# EAGLE design frankShield (EAGLE 7.5.0)
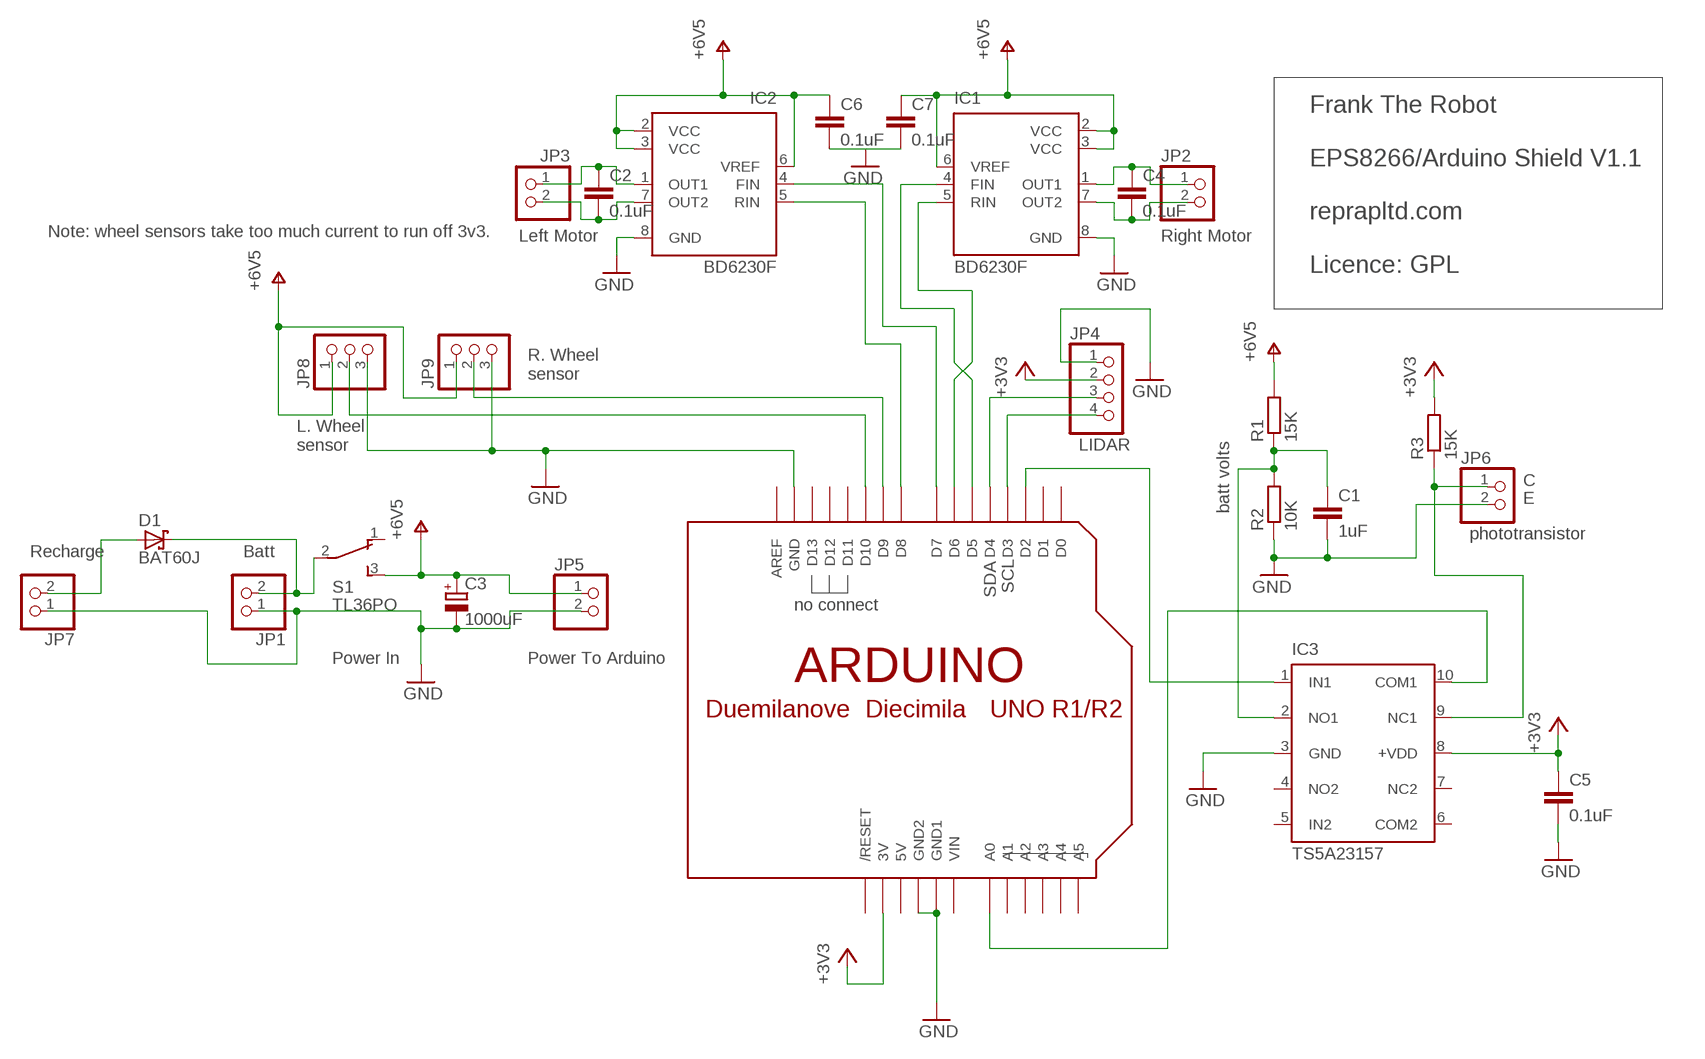
[diagram p0: schematic, sheet 1]

## Parts
C1  1uF  C-EUC0805  [C0805]
C2  0.1uF  C-EUC0805  [C0805]
C3  1000uF  CPOL-EUB45181B  [B45181B]
C4  0.1uF  C-EUC0805  [C0805]
C5  0.1uF  C-EUC0805  [C0805]
C6  0.1uF  C-EUC0805  [C0805]
C7  0.1uF  C-EUC0805  [C0805]
D1  BAT60J  [SOD323_ST]
IC1  BD6230F  [SOP8]
IC2  BD6230F  [SOP8]
IC3  TS5A23157  [MSOP10]
JP1  PINHD-1X2  [1X02]
JP2  PINHD-1X2  [1X02]
JP3  PINHD-1X2  [1X02]
JP4  PINHD-1X4  [1X04]
JP5  PINHD-1X2  [1X02]
JP6  PINHD-1X2  [1X02]
JP7  PINHD-1X2  [1X02]
JP8  PINHD-1X3  [1X03]
JP9  PINHD-1X3  [1X03]
R1  15K  R-EU_M0805  [M0805]
R2  10K  R-EU_M0805  [M0805]
R3  15K  R-EU_M0805  [M0805]
S1  TL36PO  [TL3XPO]
U$1  ARDUINO-BPLACE  [ARDUINO-BPLACE]

## Nets
+3V3: C5.1 IC3.8(+VDD) JP4.2 R3.2 U$1.3V
GND: C1.2 C3.- C5.2 C6.2 C7.2 IC1.8(GND) IC2.8(GND) IC3.3(GND) JP1.1 JP4.1 JP5.2 JP6.2 JP7.1 JP8.3 JP9.3 R2.1 U$1.GND U$1.GND1 U$1.GND2
N$1: JP4.4 U$1.D3
N$2: JP4.3 U$1.D4
N$3: C2.1 IC2.1(OUT1) JP3.1
N$4: C2.2 IC2.7(OUT2) JP3.2
N$5: C4.1 IC1.1(OUT1) JP2.1
N$6: C4.2 IC1.7(OUT2) JP2.2
N$7: IC1.5(RIN) U$1.D6
N$8: IC1.4(FIN) U$1.D5
N$9: IC2.4(FIN) U$1.D7
N$10: IC2.5(RIN) U$1.D8
N$11: IC3.10(COM1) U$1.A0
N$12: C1.1 IC3.2(NO1) R1.1 R2.2
N$13: D1.C JP1.2 S1.2(P)
N$14: IC3.9(NC1) JP6.1 R3.1
N$15: IC3.1(IN1) U$1.D2
N$16: D1.A JP7.2
N$17: JP9.2 U$1.D9
N$18: JP8.2 U$1.D10
V+: C3.+ C6.1 C7.1 IC1.2(VCC) IC1.3(VCC) IC1.6(VREF) IC2.2(VCC) IC2.3(VCC) IC2.6(VREF) JP5.1 JP8.1 JP9.1 R1.2 S1.3(S) ; supply symbol labelled +6V5
Unconnected: IC3.4(NO2) IC3.5(IN2) IC3.6(COM2) S1.1(O) U$1.A1 U$1.A2 U$1.A3 U$1.A4 U$1.A5 U$1.AREF U$1.D0 U$1.D1 U$1.D11 U$1.D12 U$1.D13 U$1.RESET(/RESET)

## Notes on the sheet
- Note: wheel sensors take too much current to run off 3v3. | Left Motor | Right Motor
- Frank The Robot
  
  EPS8266/Arduino Shield V1.1
  
  reprapltd.com
  
  Licence: GPL
- R. Wheel
  sensor
- L. Wheel
  sensor
- LIDAR
- C
- E
- batt volts
- phototransistor
- Recharge | Batt
- SDA | SCL
- no connect
- Power In | Power To Arduino

## Power pins joined to a net without a drawn wire
5V: U$1.5V
NC2: IC3.7(NC2)
VIN: U$1.VIN

## Library data of the parts
C1 C2 C4-C7 = rcl:C-EU: CAPACITOR, European symbol
C3 = rcl:CPOL-EU: POLARIZED CAPACITOR, European symbol
D1 = diode:BAT60J: Schottky barrier diode Source: www.st.com, BAT60J.pdf
IC1 IC2 = rohm:BD623*F: H-bridge driver for brush motors Source: http://www.rohm.com/products/databook/motor/pdf/bd623x_series-e.pdf; MPN: BD6230F-E2; OC_FARNELL: 1716264; OC_NEWARK: 15R0529
IC3 = reprapltd:TS5A23157: 2-Channel, 12-Bit ADC with I2C-Compatible Interface 10-Lead MSOP Source: http://www.analog.com/UploadedFiles/Data_Sheets/224965274AD7992_0.pdf; MPN: AD7992BRMZ-0; OC_FARNELL: 1078311; OC_NEWARK: 31M4422
JP1-JP3 JP5-JP7 = pinhead:PINHD-1X2: PIN HEADER
JP4 = pinhead:PINHD-1X4: PIN HEADER
JP8 JP9 = pinhead:PINHD-1X3: PIN HEADER
R1-R3 = rcl:R-EU_: RESISTOR, European symbol
S1 = switch:TL36PO: TINY SWITCH ON - ON Source: http://www2.produktinfo.conrad.com/datenblaetter/700000-724999/705152-da-01-de-Subminiaturschalter_TL_36YO.pdf
U$1 = adafruit:ARDUINO: Arduino Diecimila/Duemilanove Make a shield with ease, this package has all the named pins as well as the two mounting drill holes and an outline of the USB and DC power connector. The outline is on the DIMENSION layer, so if your board house uses it they will cut the outline to match. http://www.ladyada.net/library/pcb/eaglelibrary.html

## Board
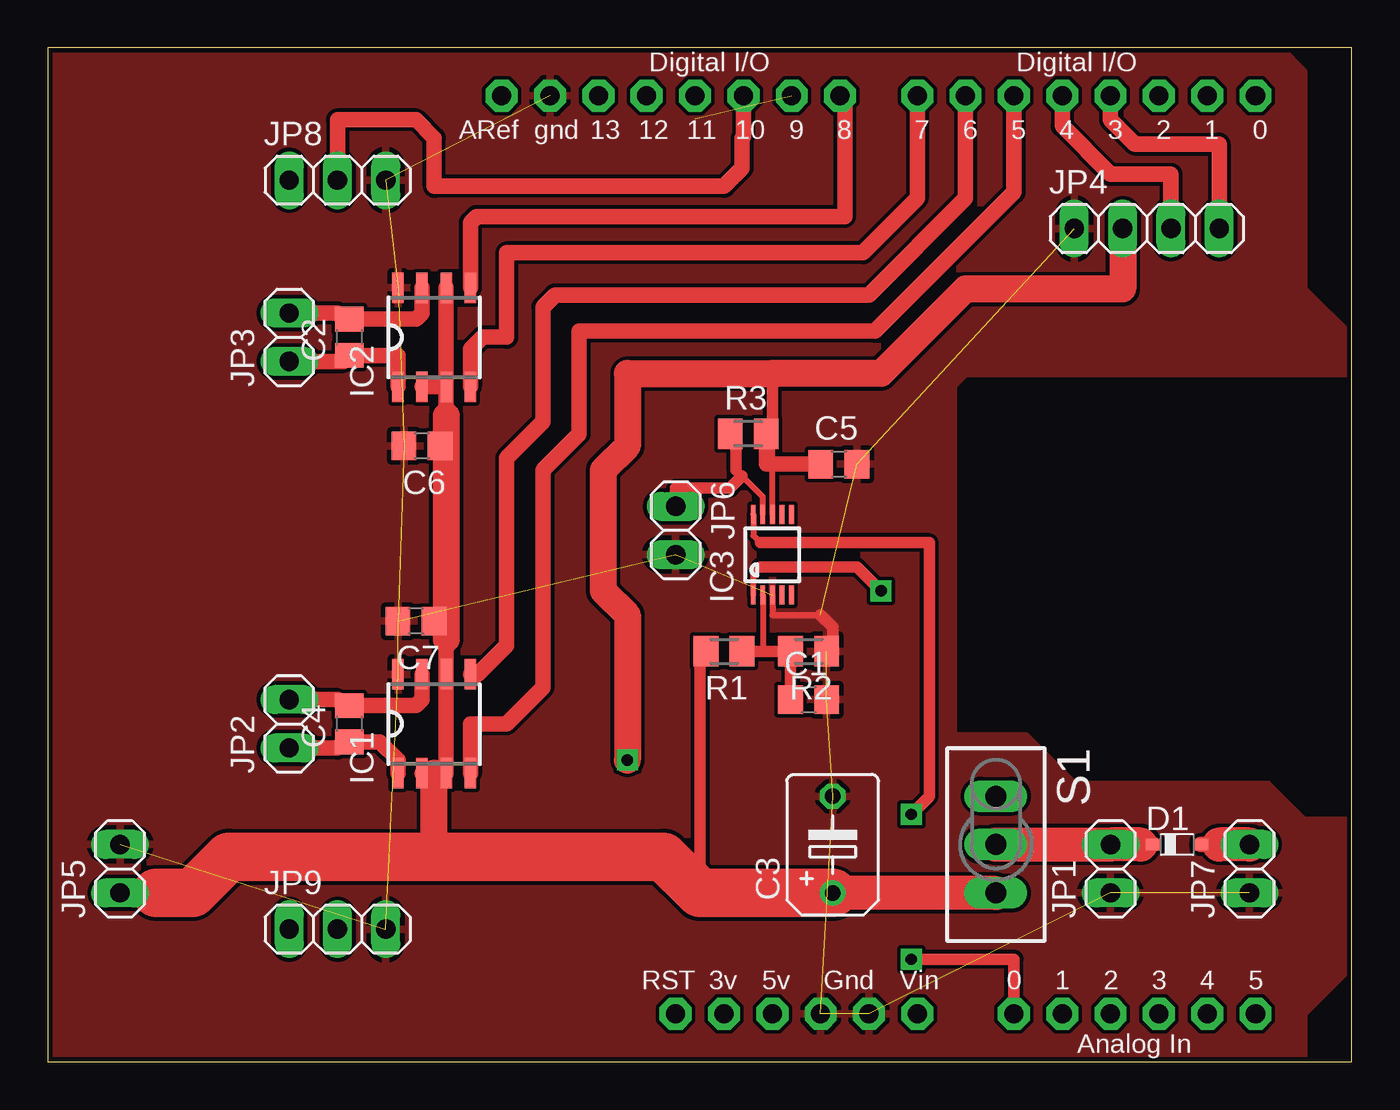
[diagram p1: board, top side]
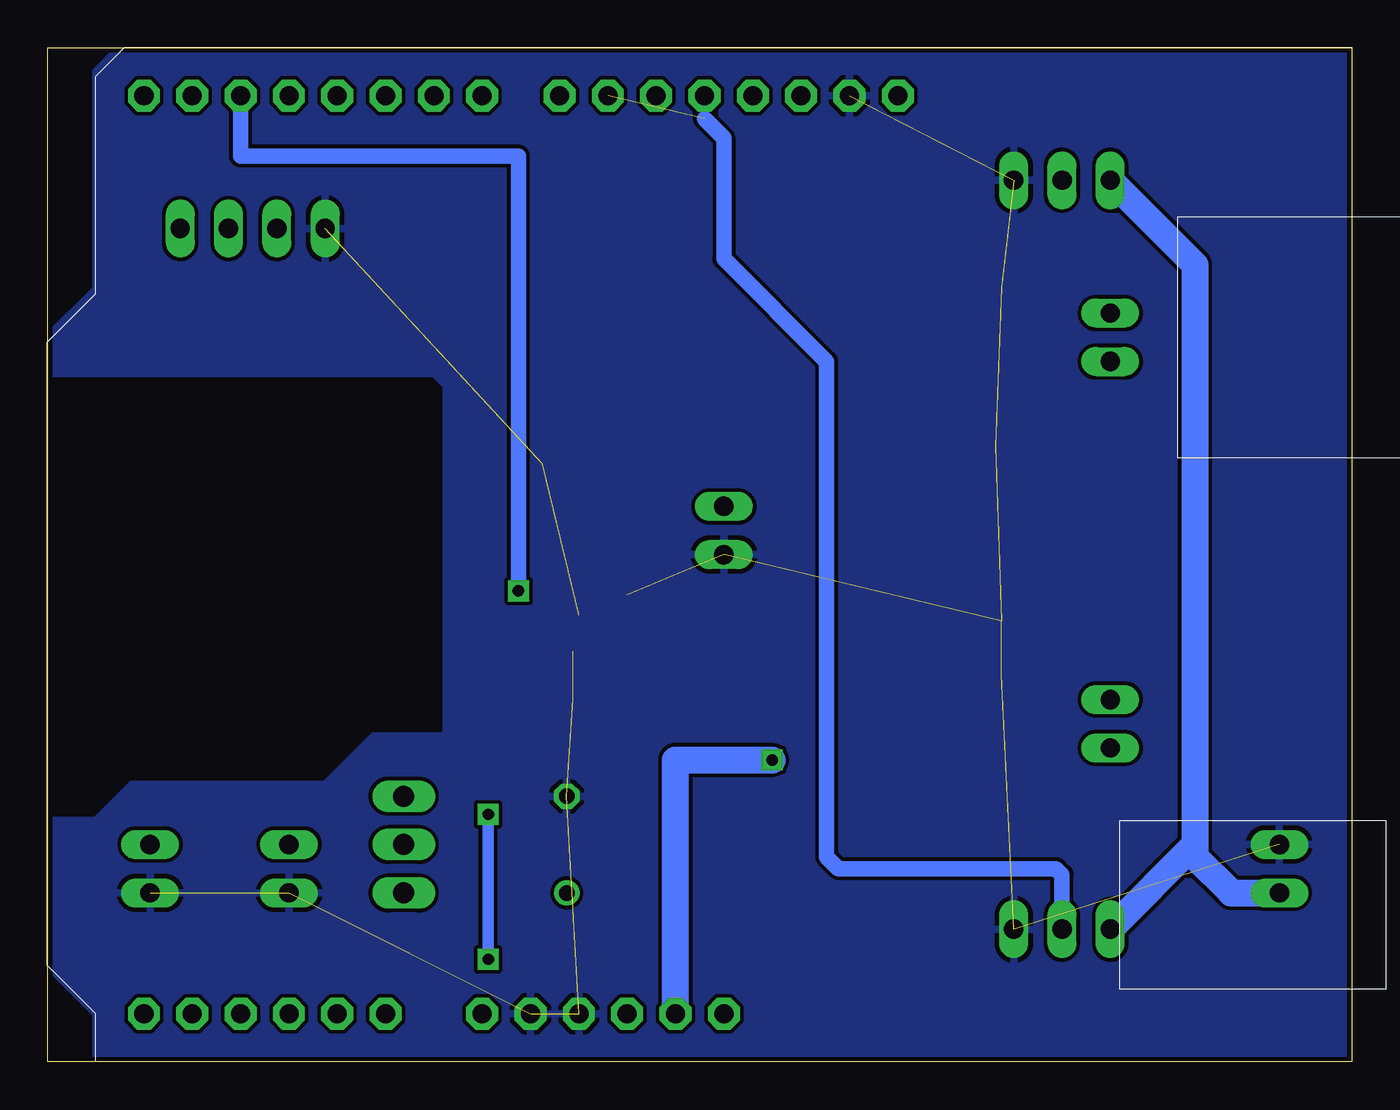
[diagram p2: board, bottom side, seen from below]

Size 68.57 x 53.33 mm. Coordinates in mm from the lower left corner, seen from the top.
Outline: 0,0 68.57,0 68.57,53.33 0,53.33 0,0
Copper layers (1*16): Top 0.035mm / dielectric 1.5mm / Bottom 0.035mm
Design rules "pcbtrain": minimum track width 0.2mm, minimum drill 0.4mm, track to track 0.2mm, track to pad 0.2mm, pad to pad 0.2mm, via to via 0.2mm, smd to smd 0mil, copper to edge 10mil, drill to drill 0.2mm, minimum pad ring 10mil, minimum via ring 10mil, stop-mask expansion 0.125mm, vias tented up to drill 0mil, thermal gap 10mil

### Footprints (pad centres in the part's own frame; a part is rotated, then mirrored left to right if it is on the bottom)
C0805 = smd 1.3 x 1.5: 1 -0.95,0; 2 0.95,0
B45181B = drill 0.813: + -2.54,0 | drill 0.813 octagon: - 2.54,0
SOD323_ST = smd 0.8 x 0.6: A 1.25,0; C -1.25,0
SOP8 = smd 0.6 x 1.6: 1 -1.905,-2.6; 2 -0.635,-2.6; 3 0.635,-2.6; 4 1.905,-2.6; 5 1.905,2.6; 6 0.635,2.6; 7 -0.635,2.6; 8 -1.905,2.6
MSOP10 = smd 0.25 x 1: 1 -1,-2.113; 2 -0.5,-2.113; 3 0,-2.113; 4 0.5,-2.113; 5 1,-2.113; 6 1,2.113; 7 0.5,2.113; 8 0,2.113; 9 -0.5,2.113; 10 -1,2.113
1X02 = drill 1.016 long: 1 -1.27,0; 2 1.27,0
1X04 = drill 1.016 long: 1 -3.81,0; 2 -1.27,0; 3 1.27,0; 4 3.81,0
1X03 = drill 1.016 long: 1 -2.54,0; 2 0,0; 3 2.54,0
M0805 = smd 1.3 x 1.6: 1 -0.95,0; 2 0.95,0
TL3XPO = drill 1.1 pad 1.422 long: 1 -2.54,0; 2 0,0; 3 2.54,0
ARDUINO-BPLACE = drill 1 pad 1.676 octagon: 3V 35.56,2.54; 5V 38.1,2.54; A0 50.8,2.54; A1 53.34,2.54; A2 55.88,2.54; A3 58.42,2.54; A4 60.96,2.54; A5 63.5,2.54; AREF 23.876,50.8; D0 63.5,50.8; D1 60.96,50.8; D2 58.42,50.8; D3 55.88,50.8; D4 53.34,50.8; D5 50.8,50.8; D6 48.26,50.8; D7 45.72,50.8; D8 41.656,50.8; D9 39.116,50.8; D10 36.576,50.8; D11 34.036,50.8; D12 31.496,50.8; D13 28.956,50.8; GND 26.416,50.8; GND1 43.18,2.54; GND2 40.64,2.54; RESET 33.02,2.54; VIN 45.72,2.54

### Placement (x,y rotation side)
C1  40.01,19.05 0 top
C2  15.88,38.1 90 top
C3  41.27,11.43 90 top
C4  15.88,17.78 90 top
C5  41.59,31.43 0 top
C6  19.68,32.38 180 top
C7  19.37,23.18 180 top
D1  59.37,11.43 0 top
IC1  20.32,17.78 0 top
IC2  20.32,38.1 0 top
IC3  38.1,26.67 0 top
JP1  55.88,10.16 90 top
JP2  12.7,17.78 90 top
JP3  12.7,38.1 90 top
JP4  57.78,43.81 0 top
JP5  3.81,10.16 90 top
JP6  33.02,27.94 270 top
JP7  63.18,10.16 90 top
JP8  15.24,46.35 0 top
JP9  15.24,6.99 0 top
R1  35.56,21.59 180 top
R2  40.01,21.59 180 top
R3  36.83,33.02 0 top
S1  49.85,11.43 270 top
U$1  0,0 0 top

### Tracks (layer width: path | path; a pad name or v marks a point on that pad's centre or on a via)
+3V3  (via drill 0.6)
  Top 0.305: IC3.8 38.1,32.7
  Top 0.406: 38.1,32.7 R3.2
  Top 0.61: 38.1,32.7 38.1,36.2
  Top 0.813: C5.1 37.78,31.43 R3.2
  Top 1.422: v30.48,15.88 30.48,23.5 29.21,24.77 29.21,31.11 30.48,32.38 30.48,36.2 38.1,36.2 43.81,36.2 48.26,40.64 56.52,40.64 JP4.2
  Bottom 1.422: U$1.3V 35.56,15.88 v30.48,15.88
GND  (17 unrouted)
  Top 0.305: IC3.3 38.1,23.5 40.64,23.5 | 41.27,22.23 40.95,21.91 R2.1
  Top 0.61: 40.64,23.5 41.27,22.86 41.27,22.23
  pour Top: 0,0 0,53.34 64.77,53.34 66.04,52.07 66.04,40.64 68.58,38.1 68.58,36.2 48.26,36.2 47.62,35.56 47.62,17.14 51.44,17.14 53.98,14.61 64.14,14.61 66.04,12.7 68.58,12.7 68.58,5.08 66.04,2.54 66.04,0
  pour Bottom: 0,0 0,53.34 64.77,53.34 66.04,52.07 66.04,40.64 68.58,38.1 68.58,36.2 48.26,36.2 47.62,35.56 47.62,17.14 51.44,17.14 53.98,14.61 64.14,14.61 66.04,12.7 68.58,12.7 68.58,5.08 66.04,2.54 66.04,0
N$1
  Top 0.813: U$1.D3 55.88,49.53 57.15,48.26 61.59,48.26 JP4.4
N$2
  Top 0.813: U$1.D4 53.34,49.21 55.88,46.67 59.05,46.67 JP4.3
N$3
  Top 0.813: IC2.1 18.41,37.15 C2.1 15.55,36.83 JP3.1
N$4
  Top 0.813: IC2.7 19.68,39.37 19.37,39.05 C2.2 | C2.2 | C2.2 15.56,39.05 15.24,39.37 JP3.2
N$5
  Top 0.813: IC1.1 18.41,15.88 17.46,16.83 C4.1 | C4.1 | C4.1 15.56,16.83 15.24,16.51 JP2.1
N$6
  Top 0.813: IC1.7 19.68,19.05 19.37,18.73 C4.2 | C4.2 | C4.2 15.56,18.73 15.24,19.05 JP2.2
N$7
  Top 0.813: U$1.D6 48.26,45.4 43.18,40.32 26.67,40.32 26.04,39.69 26.04,33.66 24.13,31.75 24.13,21.91 22.6,20.38 IC1.5
N$8
  Top 0.813: U$1.D5 50.8,45.72 43.5,38.42 27.94,38.42 27.94,33.02 26.04,31.11 26.04,19.68 24.13,17.78 22.23,17.78 IC1.4
N$9
  Top 0.813: U$1.D7 45.72,45.4 42.86,42.55 24.13,42.55 24.13,38.1 22.86,38.1 22.23,37.47 IC2.4
N$10
  Top 0.813: IC2.5 22.23,44.13 22.54,44.45 41.91,44.45 41.91,50.55 U$1.D8
N$11  (via drill 0.6)
  Top 0.305: IC3.10 37.1,27.67 37.47,27.3
  Top 0.61: 37.47,27.3 46.35,27.3 46.35,13.97 v45.4,13.02 | U$1.A0 50.8,5.4 v45.4,5.4
  Bottom 0.61: v45.4,5.4 v45.4,13.02
N$12
  Top 0.305: IC3.2 37.6,21.73
  Top 0.406: 37.6,21.73 37.47,21.59
  Top 0.61: R1.1 37.47,21.59 R2.2 C1.1
N$13
  Top 0.813: D1.C 57.47,11.43
  Top 1.778: S1.2 JP1.2 57.47,11.43
N$14
  Top 0.305: IC3.9 37.6,29.71 36.51,30.8 36.2,31.11 | 36.2,32.7 R3.1
  Top 0.61: 36.2,31.11 36.2,32.7 | JP6.1 33.02,30.16 35.88,30.16 36.51,30.8
N$15  (via drill 0.6)
  Top 0.305: IC3.1 37.1,25.67 37.47,26.04
  Top 0.61: 37.47,26.04 42.55,26.04 v43.81,24.77
  Bottom 0.813: v43.81,24.77 43.81,47.62 58.42,47.62 U$1.D2
N$16
  Top 0.813: 61.59,11.43 D1.A
  Top 1.778: JP7.2 61.59,11.43
N$17  (1 unrouted)
  Bottom 0.813: JP9.2 15.24,9.84 15.56,10.16 26.99,10.16 27.62,10.79 27.62,36.83 33.02,42.23 33.02,48.58 34.04,49.59
N$18
  Top 0.813: U$1.D10 36.58,48.64 36.51,48.58 36.51,46.99 35.56,46.04 20.32,46.04 20.32,48.58 19.37,49.53 15.24,49.53 JP8.2
V+
  Top 0.61: R1.2 34.61,21.27 34.29,21.27 34.29,8.89
  Top 0.813: IC2.2 IC2.3 | IC2.3 IC2.6 | IC1.2 20.32,15.18 IC1.3 IC1.6 20.95,22.23 | IC2.3 20.95,33.97 | C6.1 20.95,32.38 | C7.1 20.95,23.18
  Top 1.27: 5.71,8.89 5.08,8.89
  Top 1.422: JP5.1 5.08,8.89 | 20.32,10.79 20.32,15.18 | 20.95,33.97 20.95,32.38 20.95,23.18 20.95,22.23
  Top 1.778: S1.3 C3.+
  Top 2.54: C3.+ 34.29,8.89 32.38,10.79 20.32,10.79 9.53,10.79 7.62,8.89 5.71,8.89
  Bottom 1.422: JP8.1 8.26,41.91 8.26,11.43 | 8.26,11.43 JP9.1 | 8.26,11.43 8.26,10.79 6.35,8.89 JP5.1

### Text on the board
tValues: L. sense | LIDAR | sig | G | +batt | G | + | SDA | SCL | - | +3V3 | Left / Motor | C | photo | E | Right / Motor | EPS8266/Arduino Shield V1.1 / reprapltd.com / Mechanics & software: Sally Bowyer / Electronics: Adrian Bowyer / Licence - GPL | + | Frank The Robot | - | - | + | charge | Pwr | +batt | sig | G | Batt | + | - | R. sense